# EAGLE design Light_Sensor (EAGLE 6.5.0)
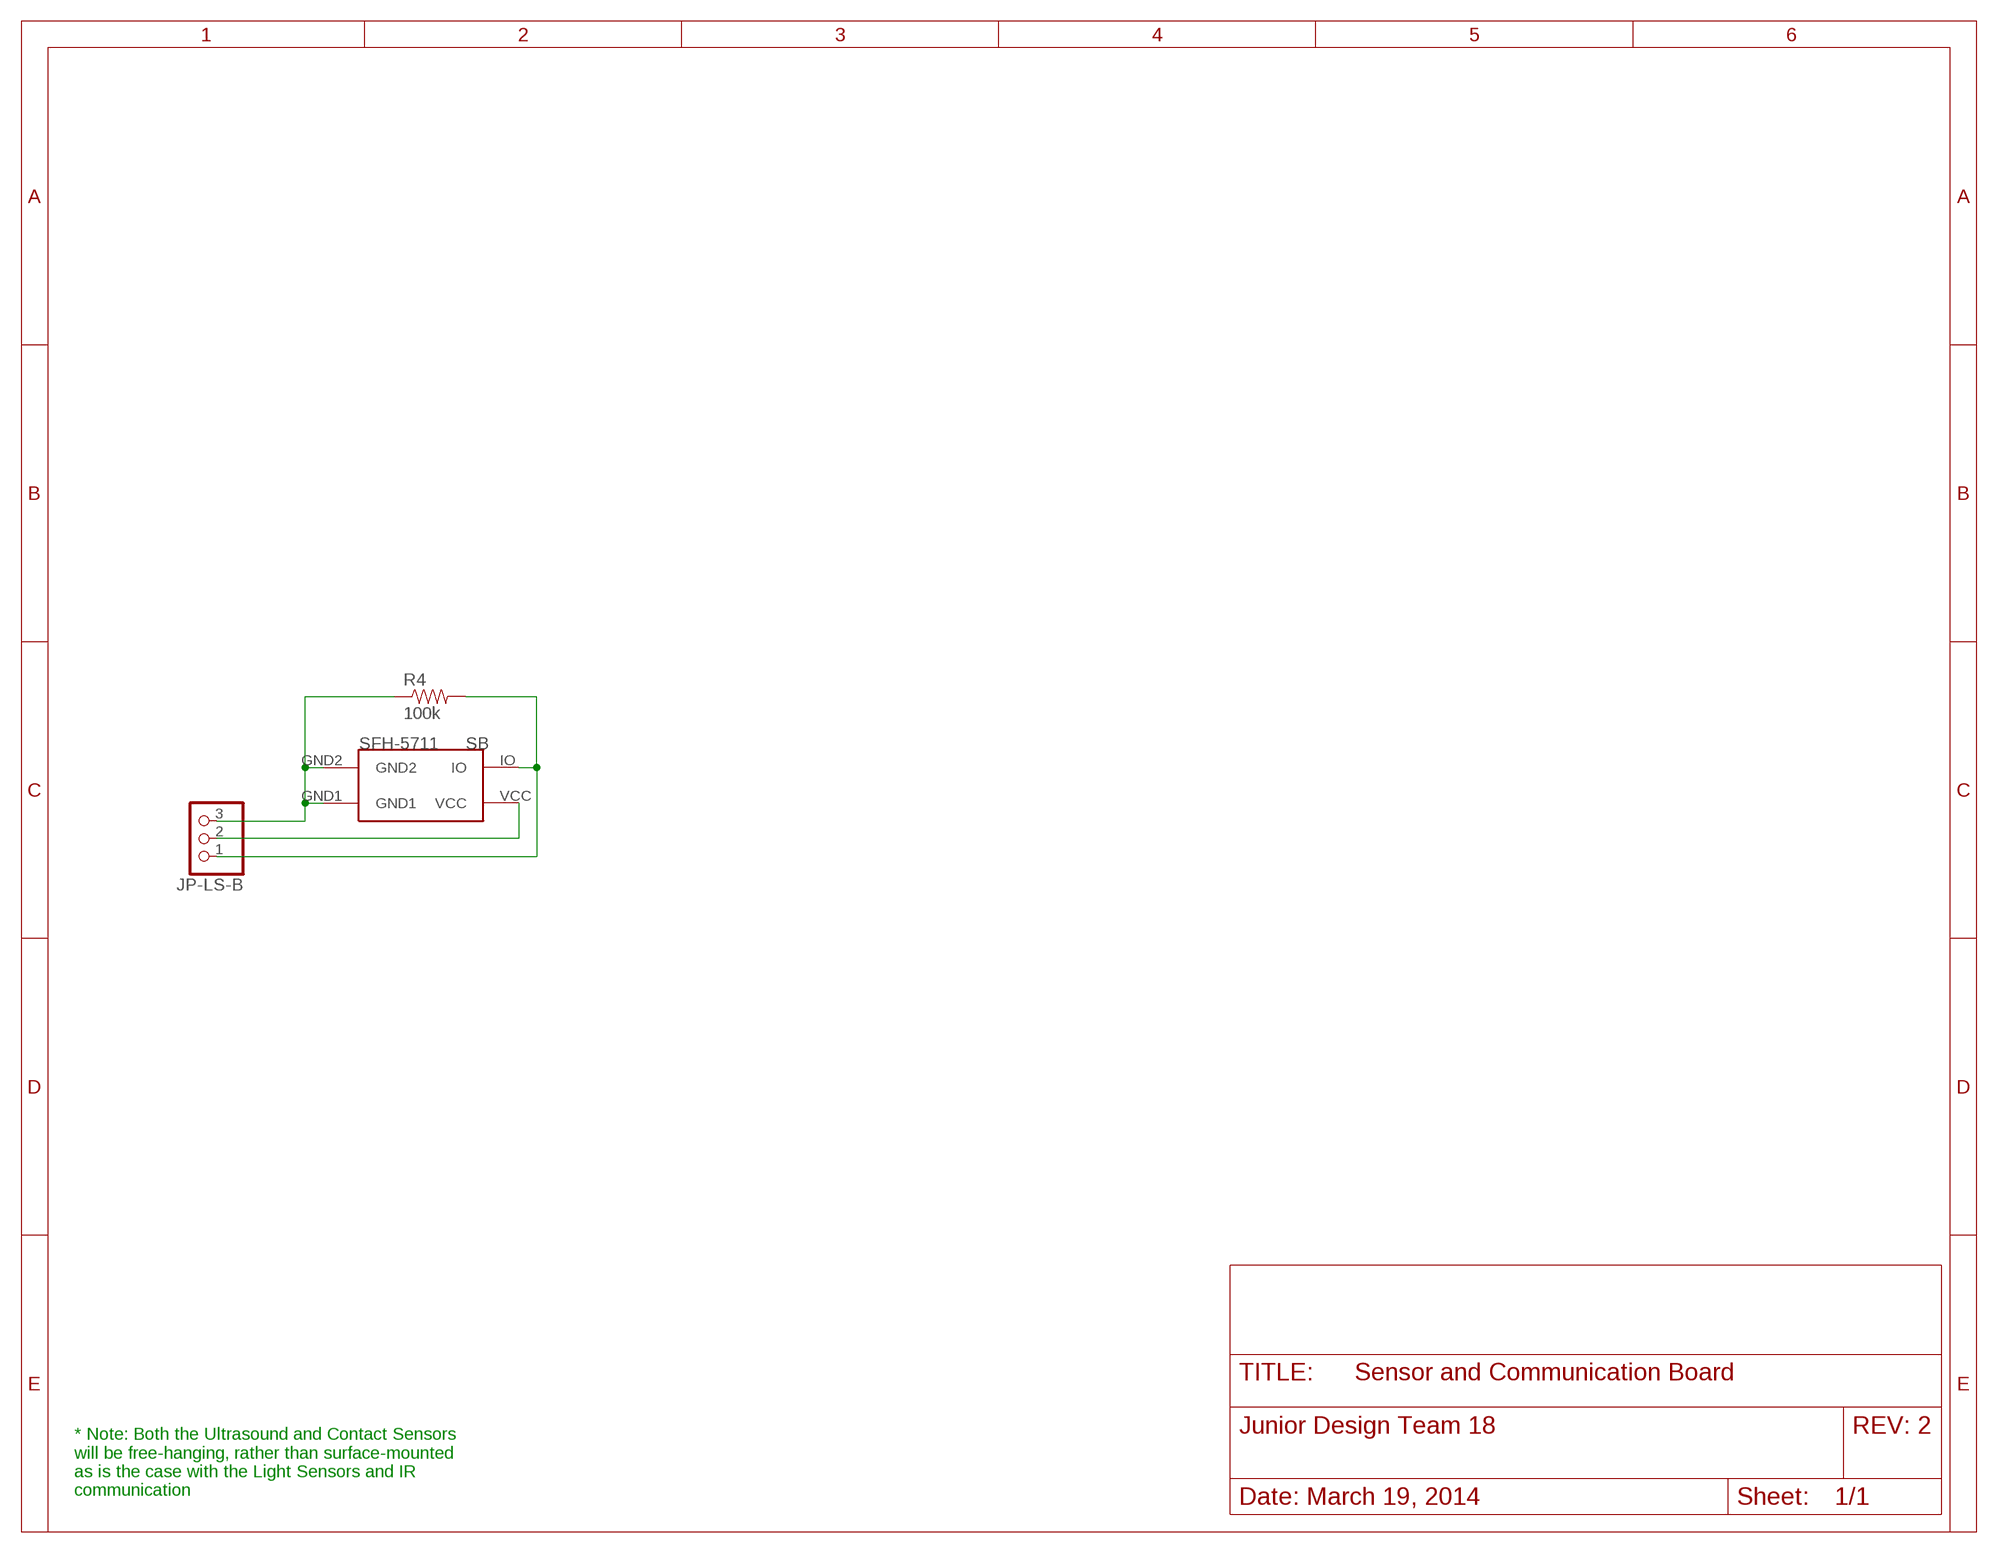
[diagram p0: schematic, sheet 1]

## Parts
JP-LS-B  PINHD-1X3  [1X03]
R4  100k  RESISTOR0805-RES  [0805]
SFH-5711-B  5711  SFH5711  [DIODE]

## Nets
GND-LS-B: JP-LS-B.3 R4.1 SFH-5711-B.GND1 SFH-5711-B.GND2
IO-LS-B: JP-LS-B.1 R4.2 SFH-5711-B.IO
VCC-LS-B: JP-LS-B.2 SFH-5711-B.VCC

## Notes on the sheet
- SFH-5711 | SB
- * Note: Both the Ultrasound and Contact Sensors
  will be free-hanging, rather than surface-mounted
  as is the case with the Light Sensors and IR
  communication

## Library data of the parts
JP-LS-B = pinhead:PINHD-1X3: PIN HEADER
R4 = beacon_board:RESISTOR: Resistor Basic schematic elements and footprints for 0603, 1206, and PTH resistors.
SFH-5711-B = JDT-18:SFH5711: SFH 5711 - Photodiode with Built-In Current Amplifier

## Net classes
0 default: width 0.152 mm, drill 0.33 mm

## Board
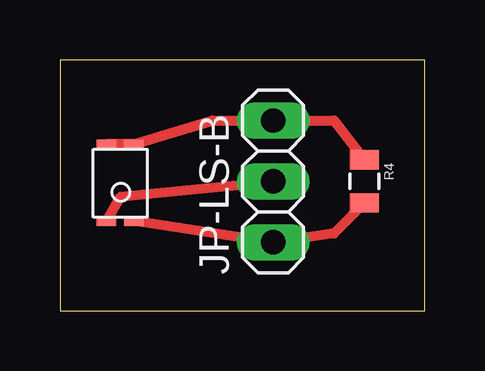
[diagram p1: board, top side]

Size 15.23 x 10.47 mm. Coordinates in mm from the lower left corner, seen from the top.
Outline: 0,0 15.23,0 15.23,10.47 0,10.47 0,0
Copper layers (1*16): Top 0.035mm / dielectric 1.5mm / Bottom 0.035mm
Design rules "default *": minimum track width 0.001525mm, minimum drill 24mil, track to track 8mil, track to pad 8mil, pad to pad 8mil, via to via 8mil, smd to smd 8mil, copper to edge 40mil, drill to drill 8mil, minimum pad ring 10mil, minimum via ring 8mil, stop-mask expansion 4mil, vias tented up to drill 0mil, thermal gap 10mil

### Footprints (pad centres in the part's own frame; a part is rotated, then mirrored left to right if it is on the bottom)
1X03 = drill 1.016 long: 1 -2.54,0; 2 0,0; 3 2.54,0
0805 = smd 0.8 x 1.2: 1 -0.9,0; 2 0.9,0
DIODE = smd 0.813 x 0.406: GND1 -0.6,1.55; GND2 0.55,1.55; IO 0.55,-1.65; VCC -0.6,-1.65

### Placement (x,y rotation side)
JP-LS-B  8.89,5.4 90 top
R4  12.7,5.4 270 top
SFH-5711-B  2.54,5.4 0 top

### Tracks (layer width: path | path; a pad name or v marks a point on that pad's centre or on a via)
GND-LS-B
  Top 0.406: SFH-5711-B.GND1 SFH-5711-B.GND2 6.35,7.94 JP-LS-B.3 11.43,7.94 R4.1
IO-LS-B
  Top 0.406: R4.2 11.43,3.23 JP-LS-B.1 SFH-5711-B.IO
VCC-LS-B
  Top 0.406: SFH-5711-B.VCC 2.54,4.76 JP-LS-B.2